# Altium schematic sheet other.SchDoc
size A4
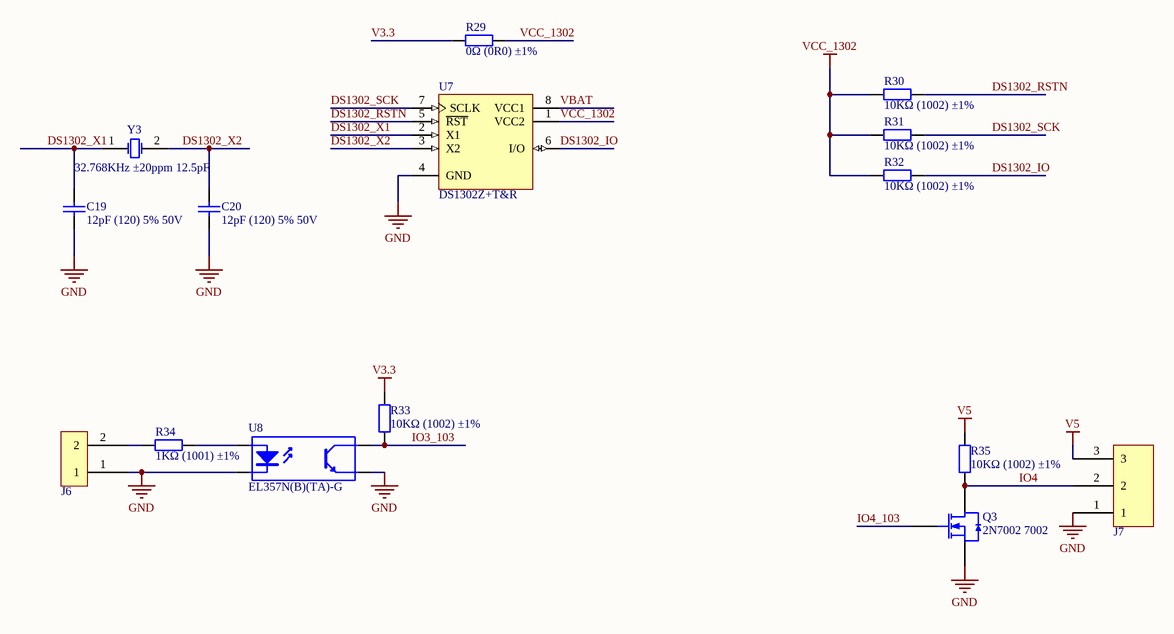
[diagram p0: other.SchDoc]

## Parts
C19  12pF (120) 5% 50V  [0603_C]
C20  12pF (120) 5% 50V  [0603_C]
J6  KF301-2P  [KF301-2P]  (value not drawn)
J7  KF301-3P  [KF301-3P]  (value not drawn)
Q3  2N7002 7002  [SOT-23(SOT-23-3)]
R29  0Ω (0R0) ±1%  [1206_R]
R30  10KΩ (1002) ±1%  [0603_R]
R31  10KΩ (1002) ±1%  [0603_R]
R32  10KΩ (1002) ±1%  [0603_R]
R33  10KΩ (1002) ±1%  [1206_R]
R34  1KΩ (1001) ±1%  [1206_R]
R35  10KΩ (1002) ±1%  [1206_R]
U7  DS1302Z+T&R  [SOIC-8_150mil]
U8  EL357N(B)(TA)-G  [SOP-4_P2.54]
Y3  32.768KHz ±20ppm 12.5pF  [SMD-3215_2P FC - 135]

## Nets
GND: C19.1 C20.1 J6.1 J7.1 Q3.2(S) U7.4(GND) U8.2(K) U8.3(E)
V3.3: R29.1 R33.2
V5: J7.3 R35.2
VCC_1302: R29.2 R30.1 R31.1 R32.1 U7.1(VCC2)
DS1302_IO: R32.2 U7.6(I/O)
DS1302_RSTN: R30.2 U7.5(~{RST})
DS1302_SCK: R31.2 U7.7(SCLK)
DS1302_X1: C19.2 U7.2(X1) Y3.1(OSC1)
DS1302_X2: C20.2 U7.3(X2) Y3.2(OSC2)
IO3_103: R33.1 U8.4(C)
IO4: J7.2 Q3.3(D) R35.1
IO4_103: Q3.1(G)
VBAT: U7.8(VCC1)
NetJ6_2: J6.2 R34.1
NetR34_2: R34.2 U8.1(A)

## Library data of the parts
C19 C20 = 0603 12pF (120) 5% 50V: 贴片电容; ComponentLink1Description: 供应商链接; ComponentLink1URL: http://www.szlcsc.com/product/details_39506.html; Package: 0603; Supplier: LC; SuppliersPartNumber: C38523
Q3 = 2N7002 7002: MOS(场效应管); ComponentLink1Description: 供应商链接; ComponentLink1URL: http://www.szlcsc.com/product/details_9040.html; Package: SOT-23(SOT-23-3); Supplier: LC; SuppliersPartNumber: C8545
R29 = 1206 0Ω (0R0) 1%: 贴片电阻; ComponentLink1Description: 供应商链接; ComponentLink1URL: http://www.szlcsc.com/product/details_18576.html; Package: 1206; Supplier: LC; SuppliersPartNumber: C17888
R30-R32 = 0603 10KΩ (1002) 1%: 贴片电阻; ComponentLink1Description: 供应商链接; ComponentLink1URL: http://www.szlcsc.com/product/details_26547.html; Package: 0603; Supplier: LC; SuppliersPartNumber: C25804
R33 R35 = 1206 10KΩ (1002) 1%: 贴片电阻; ComponentLink1Description: 供应商链接; ComponentLink1URL: http://www.szlcsc.com/product/details_18590.html; Package: 1206; Supplier: LC; SuppliersPartNumber: C17902
R34 = 1206 1KΩ (1001) 1%: 贴片电阻; ComponentLink1Description: 供应商链接; ComponentLink1URL: http://www.szlcsc.com/product/details_4817.html; Package: 1206; Supplier: LC; SuppliersPartNumber: C4410
U7 = DS1302Z+T&R_[C8959]: 实时时钟; ComponentLink1Description: 供应商链接; ComponentLink1URL: http://www.szlcsc.com/product/details_9478.html; Package: SOIC-8_150mil; Supplier: LC; SuppliersPartNumber: C8959
U8 = EL357N(B)(TA)-G_[C6649]: 贴片光耦; ComponentLink1Description: 供应商链接; ComponentLink1URL: http://www.szlcsc.com/product/details_7114.html; Package: SOP-4_P2.54; Supplier: LC; SuppliersPartNumber: C6649
Y3 = SMD-3215_2P 32.768KHz 20ppm 12.5pF: 贴片晶振; ComponentLink1Description: 供应商链接; ComponentLink1URL: http://www.szlcsc.com/product/details_33310.html; Package: SMD-3215_2P; Supplier: LC; SuppliersPartNumber: C32346